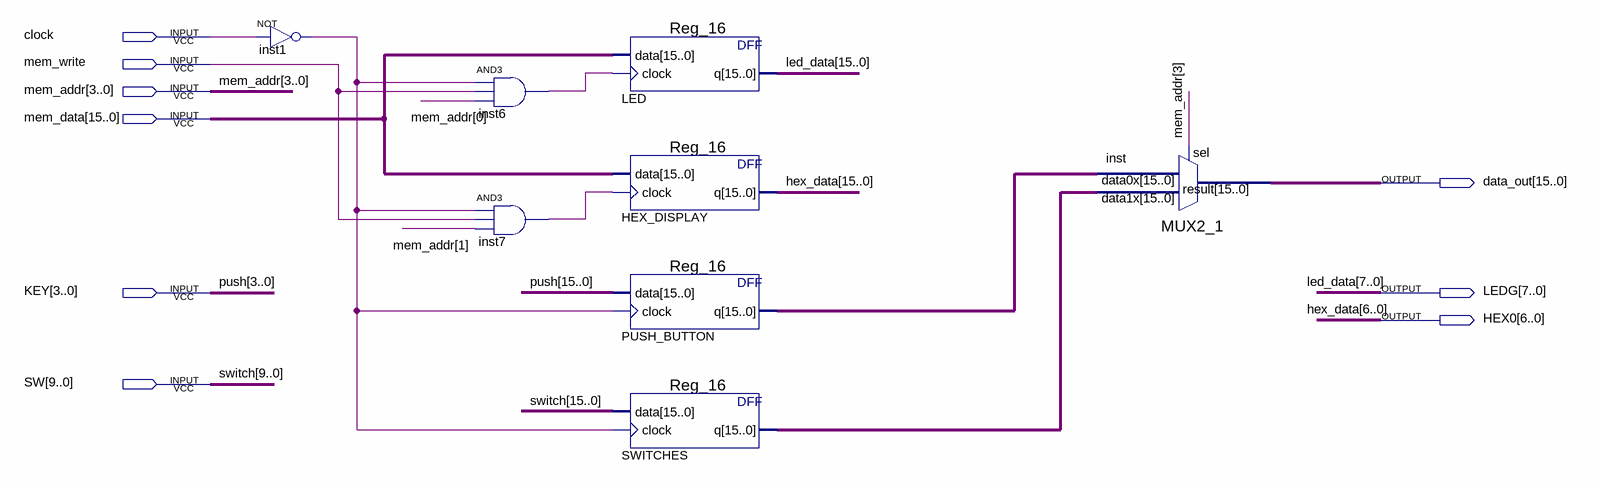
[diagram p0: schematic sheet]
// Quartus schematic IO_MemoryInterface.bdf as structural Verilog: 8 symbols, 9 pins
module IO_MemoryInterface (
  input  clock,
  input  mem_write,
  input  [3:0] mem_addr,
  input  [15:0] mem_data,
  input  [3:0] KEY,
  input  [9:0] SW,
  output [15:0] data_out,
  output [7:0] LEDG,
  output [6:0] HEX0
);

  wire inst1_out, inst6_out, inst7_out;
  wire [15:0] PUSH_BUTTON_q, SWITCHES_q;
  wire [15:4] push;
  wire [15:7] hex_data;
  wire [15:8] led_data;
  wire [15:10] switch;

  not inst1 (inst1_out, clock);
  and inst6 (inst6_out, inst1_out, mem_write, mem_addr[0]);
  and inst7 (inst7_out, inst1_out, mem_write, mem_addr[1]);
  Reg_16 LED (.data(mem_data), .clock(inst6_out), .q({led_data, LEDG}));
  Reg_16 HEX_DISPLAY (.data(mem_data), .clock(inst7_out), .q({hex_data, HEX0}));
  Reg_16 PUSH_BUTTON (.data({push, KEY}), .clock(inst1_out), .q(PUSH_BUTTON_q));
  Reg_16 SWITCHES (.data({switch, SW}), .clock(inst1_out), .q(SWITCHES_q));
  MUX2_1 inst (.data1x(SWITCHES_q), .data0x(PUSH_BUTTON_q), .sel(mem_addr[3]), .result(data_out));

  // Other names for the same wires on the sheet: hex_data[6:0] = HEX0; led_data[7:0] = LEDG; push[3:0] = KEY;
  //   switch[9:0] = SW
endmodule
